# Altium schematic sheet 9250.SchDoc
size A4
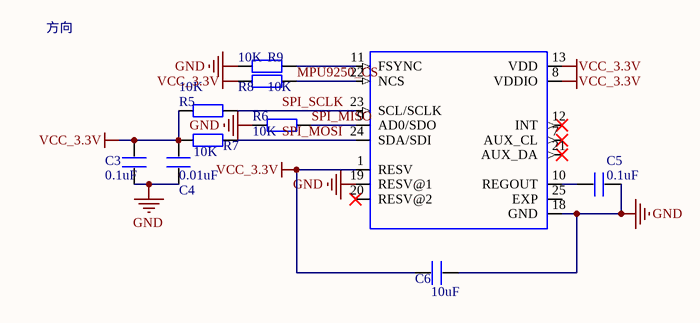
[diagram p0: 9250.SchDoc]

## Parts
C3  0.1uF  [0805]
C4  0.01uF  [0805]
C5  0.1uF  [0805]
C6  10uF  [0805]
R5  value 10K  [0805]  (hidden comment: Res2)
R6  value 10K  [0805]  (hidden comment: Res2)
R7  value 10K  [0805]  (hidden comment: Res2)
R8  value 10K  [0805]  (hidden comment: Res2)
R9  value 10K  [0805]  (hidden comment: Res2)
U9250  MPU-9250  [QFN40P300X300X105-25N]  (value not drawn)

## Nets
GND: C3.1 C4.1 C5.1 C6.1 R6.2 R9.1 U9250.18(GND) U9250.19(RESV@1)
VCC_3.3V: C3.2 C4.2 C6.2 R5.1 R7.1 R8.1 U9250.1(RESV) U9250.8(VDDIO) U9250.13(VDD)
MPU9250_CS: R8.2 U9250.22(NCS)
SPI_MISO: R6.1 U9250.9(AD0/SDO)
SPI_MOSI: R7.2 U9250.24(SDA/SDI)
SPI_SCLK: R5.2 U9250.23(SCL/SCLK)
NetC5_2: C5.2 U9250.10(REGOUT)
NetR9_2: R9.2 U9250.11(FSYNC)

Not connected (* = marked no-connect by the designer): U9250 7(AUX_CL)* 12(INT)* 20(RESV@2)* 21(AUX_DA)* 25(EXP)

## Notes on the sheet
- 方向

## Library data of the parts
C3-C6 = C
R5-R9 = Res2: Resistor; Published: 8-Jun-2000; LatestRevisionDate: 17-Jul-2002; LatestRevisionNote: Re-released for DXP Platform.; PackageReference: AXIAL-0.4; Publisher: Altium Limited; PackageDescription: Axial Device, Thru-Hole; 2 Leads; 0.4 in Pin Spacing
U9250 = MPU-9250: Value: *